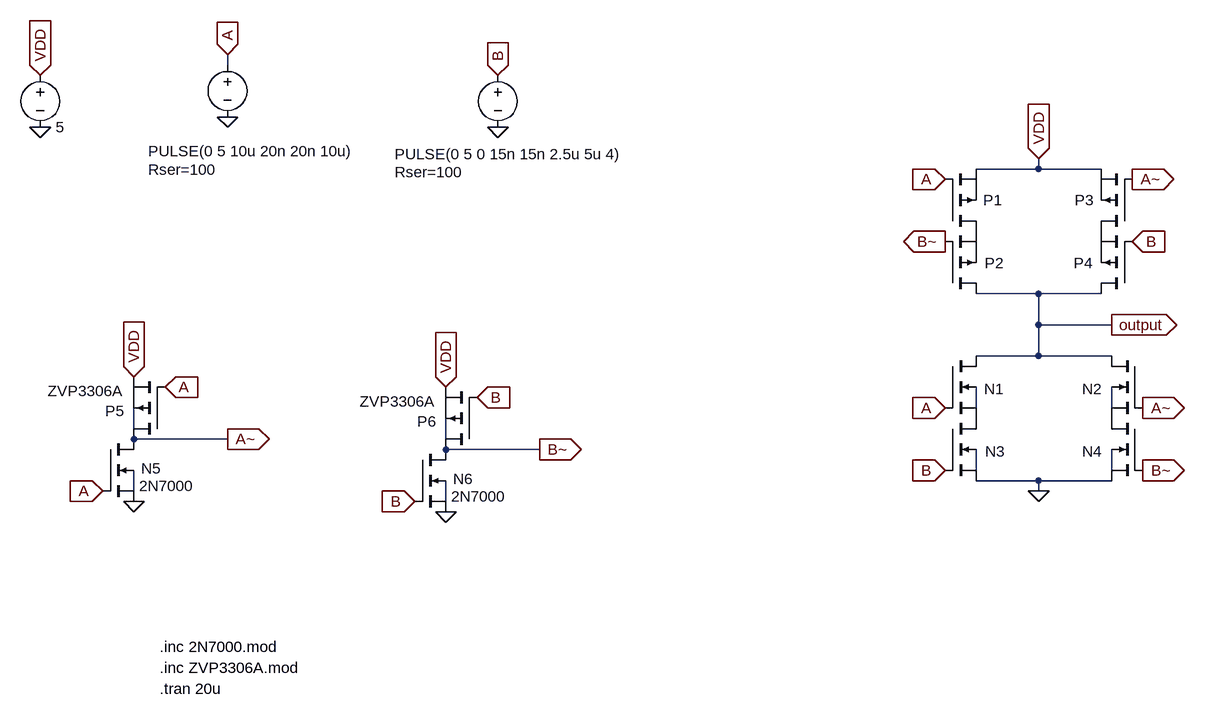
[diagram p0: schematic XOR.asc]
XOR.asc, the LTspice schematic file:
Version 4.1
SHEET 1 2308 976
WIRE -304 -240 -304 -256
WIRE 944 -80 944 -96
WIRE 944 -80 848 -80
WIRE 1040 -80 944 -80
WIRE 944 112 848 112
WIRE 1040 112 944 112
WIRE 944 160 944 112
WIRE 1056 160 944 160
WIRE 944 208 944 160
WIRE 944 208 848 208
WIRE 1056 208 944 208
WIRE 848 288 848 256
WIRE 1056 288 1056 256
WIRE -448 320 -448 288
WIRE -304 336 -448 336
WIRE 32 336 32 304
WIRE 176 352 32 352
WIRE 848 384 848 352
WIRE 1056 384 1056 352
WIRE 944 400 848 400
WIRE 1056 400 944 400
WIRE -448 416 -448 384
WIRE 944 416 944 400
WIRE 32 432 32 400
FLAG -592 -224 VDD
IOPIN -592 -224 In
FLAG -592 -144 0
FLAG -304 -256 A
IOPIN -304 -256 In
FLAG 112 -224 B
IOPIN 112 -224 In
FLAG -304 -160 0
FLAG 112 -144 0
FLAG 944 -96 VDD
IOPIN 944 -96 In
FLAG -448 432 0
FLAG -304 336 A~
IOPIN -304 336 Out
FLAG -400 256 A
IOPIN -400 256 In
FLAG -496 416 A
IOPIN -496 416 In
FLAG 32 448 0
FLAG 176 352 B~
IOPIN 176 352 Out
FLAG 80 272 B
IOPIN 80 272 In
FLAG -16 432 B
IOPIN -16 432 In
FLAG 944 416 0
FLAG 1056 160 output
IOPIN 1056 160 Out
FLAG 800 -64 A
IOPIN 800 -64 In
FLAG 800 288 A
IOPIN 800 288 In
FLAG 800 384 B
IOPIN 800 384 In
FLAG 1088 32 B
IOPIN 1088 32 In
FLAG 800 32 B~
IOPIN 800 32 Out
FLAG 1104 384 B~
IOPIN 1104 384 Out
FLAG 1088 -64 A~
IOPIN 1088 -64 Out
FLAG 1104 288 A~
IOPIN 1104 288 Out
FLAG -448 240 VDD
IOPIN -448 240 In
FLAG 32 256 VDD
IOPIN 32 256 In
SYMBOL voltage -592 -240 R0
WINDOW 0 24 16 Invisible 2
WINDOW 123 0 0 Left 0
WINDOW 39 0 0 Left 0
SYMATTR InstName VDD1
SYMATTR Value 5
SYMBOL voltage -304 -256 R0
WINDOW 0 24 16 Invisible 2
WINDOW 3 -122 149 Left 2
WINDOW 123 0 0 Left 0
WINDOW 39 -122 177 Left 2
SYMATTR InstName A1
SYMATTR Value PULSE(0 5 10u 20n 20n 10u)
SYMATTR SpiceLine Rser=100
SYMBOL voltage 112 -240 R0
WINDOW 0 24 16 Invisible 2
WINDOW 3 -159 137 Left 2
WINDOW 123 0 0 Left 0
WINDOW 39 -159 165 Left 2
SYMATTR InstName B1
SYMATTR Value PULSE(0 5 0 15n 15n 2.5u 5u 4)
SYMATTR SpiceLine Rser=100
SYMBOL nmos4 800 208 R0
WINDOW 0 60 51 Left 2
WINDOW 3 56 72 Invisible 2
SYMATTR InstName N1
SYMATTR Value 2N7000
SYMATTR Prefix X
SYMBOL pmos 800 16 M180
WINDOW 0 59 48 Left 2
WINDOW 3 56 72 Invisible 2
SYMATTR InstName P1
SYMATTR Value ZVP3306A
SYMATTR Prefix X
SYMBOL nmos4 1104 208 M0
WINDOW 0 62 51 Left 2
WINDOW 3 56 72 Invisible 2
SYMATTR InstName N2
SYMATTR Value 2N7000
SYMATTR Prefix X
SYMBOL pmos 800 112 M180
WINDOW 0 61 47 Left 2
WINDOW 3 56 72 Invisible 2
SYMATTR InstName P2
SYMATTR Value ZVP3306A
SYMATTR Prefix X
SYMBOL pmos 1088 16 R180
WINDOW 0 59 48 Left 2
WINDOW 3 56 72 Invisible 2
SYMATTR InstName P3
SYMATTR Value ZVP3306A
SYMATTR Prefix X
SYMBOL pmos 1088 112 R180
WINDOW 0 61 47 Left 2
WINDOW 3 56 72 Invisible 2
SYMATTR InstName P4
SYMATTR Value ZVP3306A
SYMATTR Prefix X
SYMBOL nmos4 -496 336 R0
WINDOW 0 59 45 Left 2
SYMATTR InstName N5
SYMATTR Value 2N7000
SYMATTR Prefix X
SYMBOL pmos -400 336 R180
WINDOW 0 63 43 Left 2
WINDOW 3 64 74 Left 2
SYMATTR InstName P5
SYMATTR Value ZVP3306A
SYMATTR Prefix X
SYMBOL nmos4 -16 352 R0
WINDOW 0 59 45 Left 2
SYMATTR InstName N6
SYMATTR Value 2N7000
SYMATTR Prefix X
SYMBOL pmos 80 352 R180
WINDOW 0 63 43 Left 2
WINDOW 3 64 74 Left 2
SYMATTR InstName P6
SYMATTR Value ZVP3306A
SYMATTR Prefix X
SYMBOL nmos4 1104 304 M0
WINDOW 0 62 51 Left 2
WINDOW 3 56 72 Invisible 2
SYMATTR InstName N4
SYMATTR Value 2N7000
SYMATTR Prefix X
SYMBOL nmos4 800 304 R0
WINDOW 0 62 51 Left 2
WINDOW 3 56 72 Invisible 2
SYMATTR InstName N3
SYMATTR Value 2N7000
SYMATTR Prefix X
TEXT -408 656 Left 2 !.inc 2N7000.mod
TEXT -408 688 Left 2 !.inc ZVP3306A.mod
TEXT -408 720 Left 2 !.tran 20u

The netlist it stands for:
* XOR.asc
VDD1 VDD 0 5
V§A1 A 0 PULSE(0 5 10u 20n 20n 10u) Rser=100
V§B1 B 0 PULSE(0 5 0 15n 15n 2.5u 5u 4) Rser=100
X§N1 output A P001 N001 2N7000  ; pins D G S B
X§P1 P002 A VDD ZVP3306A  ; pins D G S
X§N2 output A~ P003 N002 2N7000  ; pins D G S B
X§P2 output B~ P002 ZVP3306A  ; pins D G S
X§P3 P004 A~ VDD ZVP3306A  ; pins D G S
X§P4 output B P004 ZVP3306A  ; pins D G S
X§N5 A~ A 0 N007 2N7000  ; pins D G S B
X§P5 A~ A VDD ZVP3306A  ; pins D G S
X§N6 B~ B 0 N008 2N7000  ; pins D G S B
X§P6 B~ B VDD ZVP3306A  ; pins D G S
X§N4 P003 B~ 0 N006 2N7000  ; pins D G S B
X§N3 P001 B 0 N005 2N7000  ; pins D G S B
.inc 2N7000.mod
.inc ZVP3306A.mod
.tran 20u
.backanno
.end